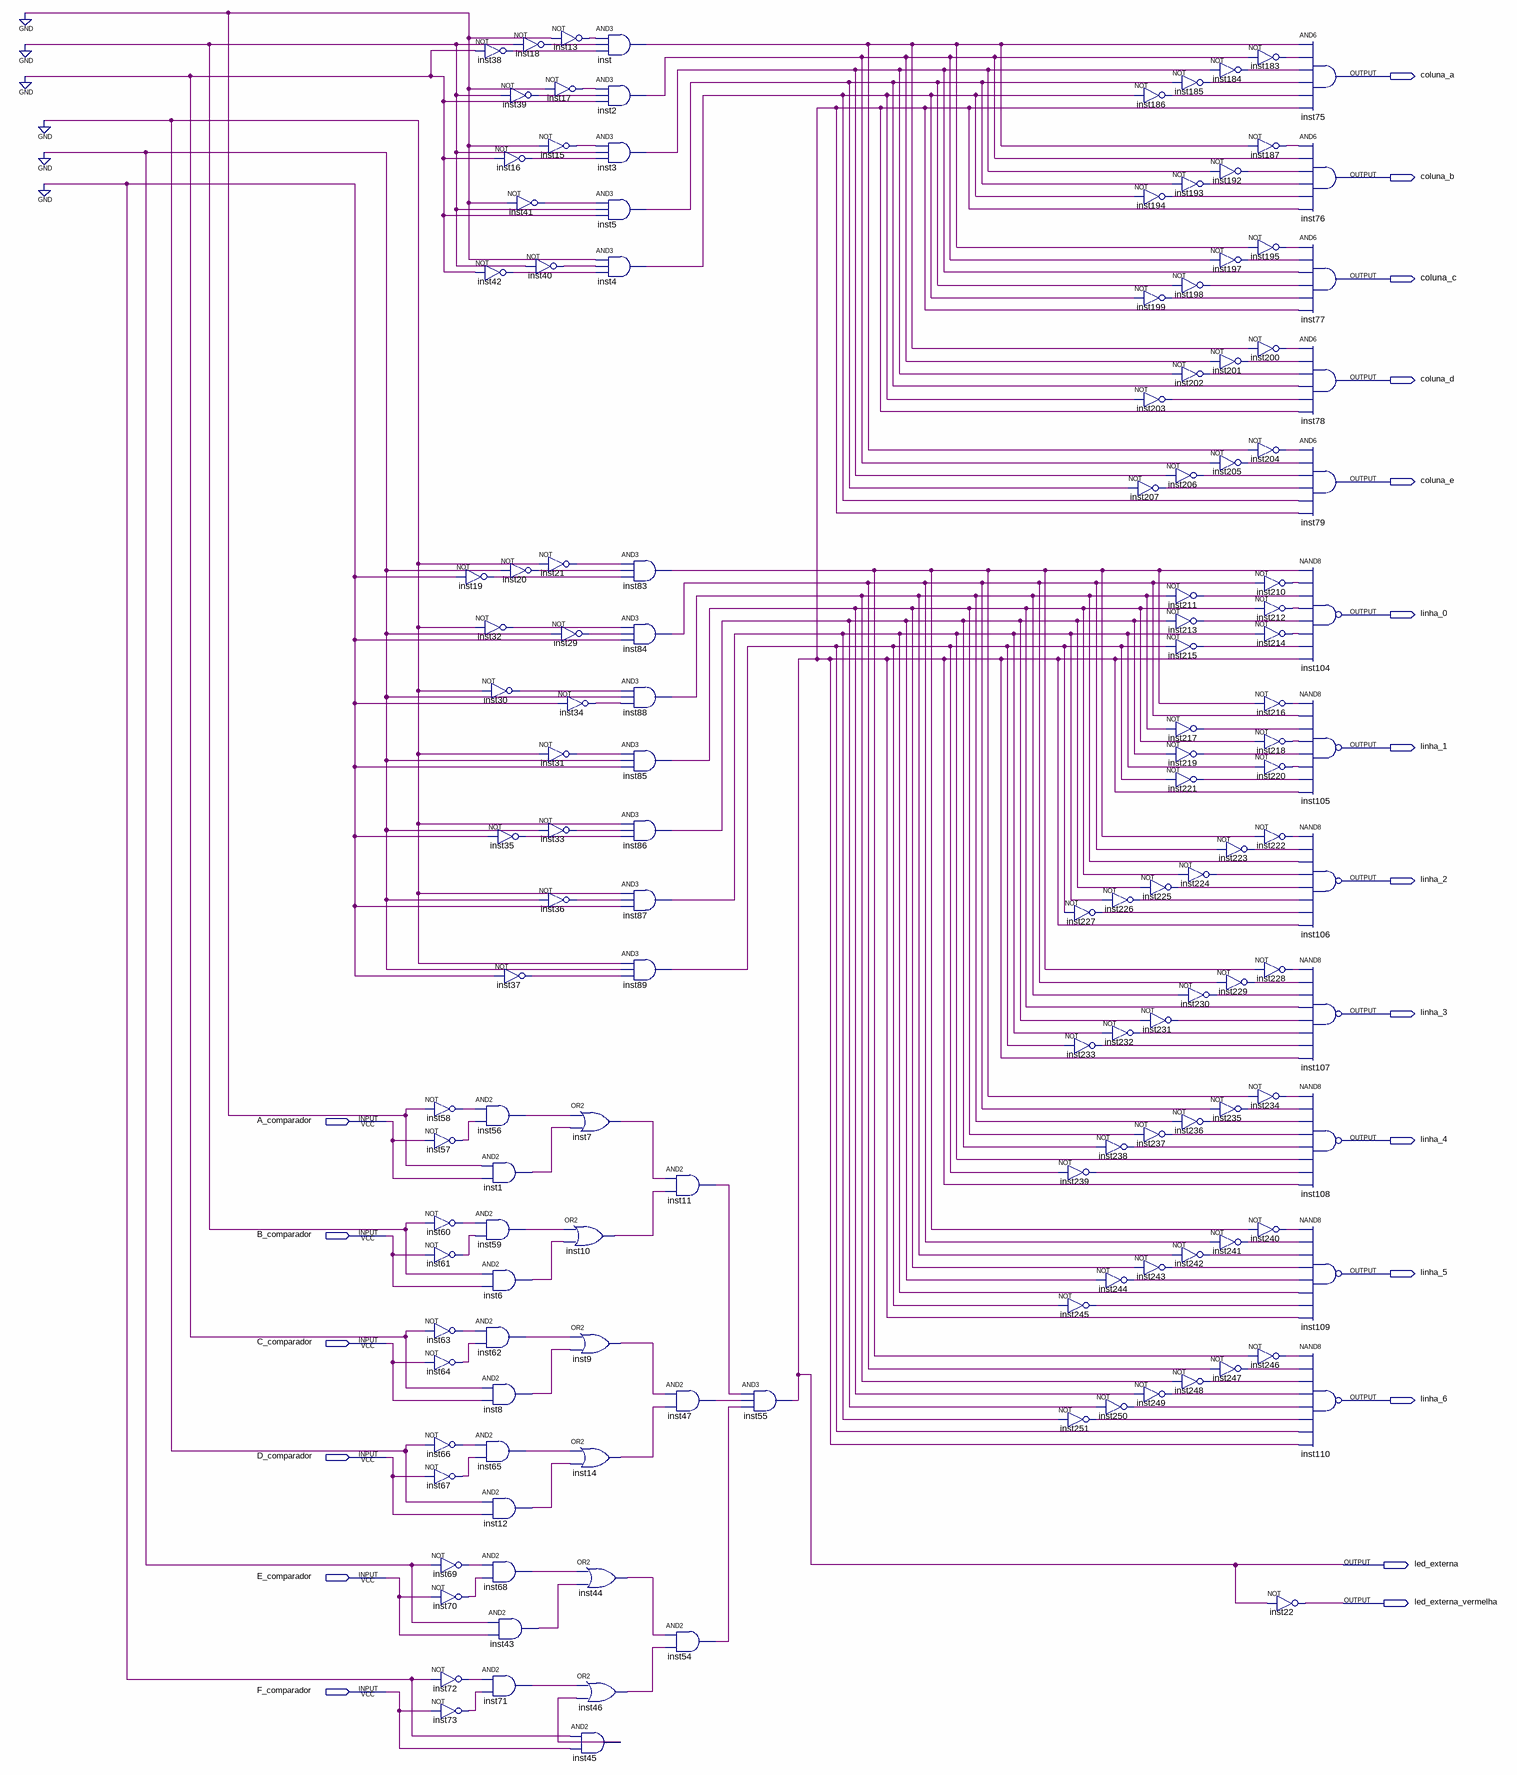
[diagram p0: schematic sheet]
// Quartus schematic PBL_decodificador.bdf as structural Verilog: 143 symbols, 20 pins
module PBL_decodificador (
  input  A_comparador,
  input  B_comparador,
  input  C_comparador,
  input  D_comparador,
  input  E_comparador,
  input  F_comparador,
  output coluna_a,
  output coluna_b,
  output coluna_c,
  output coluna_d,
  output coluna_e,
  output linha_0,
  output linha_1,
  output linha_2,
  output linha_3,
  output linha_4,
  output linha_5,
  output linha_6,
  output led_externa,
  output led_externa_vermelha
);

  wire inst1_out, inst2_out, inst3_out, inst4_out, inst5_out, inst6_out, inst7_out, inst8_out, inst9_out,
       inst10_out, inst11_out, inst12_out, inst13_out, inst14_out, inst15_out, inst16_out, inst17_out,
       inst18_out, inst19_out, inst20_out, inst21_out, inst29_out, inst30_out, inst31_out, inst32_out,
       inst33_out, inst34_out, inst35_out, inst36_out, inst37_out, inst38_out, inst39_out, inst40_out,
       inst41_out, inst42_out, inst43_out, inst44_out, inst45_out, inst46_out, inst47_out, inst54_out,
       inst56_out, inst57_out, inst58_out, inst59_out, inst60_out, inst61_out, inst62_out, inst63_out,
       inst64_out, inst65_out, inst66_out, inst67_out, inst68_out, inst69_out, inst70_out, inst71_out,
       inst72_out, inst73_out, inst83_out, inst84_out, inst85_out, inst86_out, inst87_out, inst88_out,
       inst89_out, inst183_out, inst184_out, inst185_out, inst186_out, inst187_out, inst192_out, inst193_out,
       inst194_out, inst195_out, inst197_out, inst198_out, inst199_out, inst200_out, inst201_out,
       inst202_out, inst203_out, inst204_out, inst205_out, inst206_out, inst207_out, inst210_out,
       inst211_out, inst212_out, inst213_out, inst214_out, inst215_out, inst216_out, inst217_out,
       inst218_out, inst219_out, inst220_out, inst221_out, inst222_out, inst223_out, inst224_out,
       inst225_out, inst226_out, inst227_out, inst228_out, inst229_out, inst230_out, inst231_out,
       inst232_out, inst233_out, inst234_out, inst235_out, inst236_out, inst237_out, inst238_out,
       inst239_out, inst240_out, inst241_out, inst242_out, inst243_out, inst244_out, inst245_out,
       inst246_out, inst247_out, inst248_out, inst249_out, inst250_out, inst251_out, inst_out;

  not inst58 (inst58_out, 1'b0);
  not inst57 (inst57_out, A_comparador);
  not inst60 (inst60_out, 1'b0);
  not inst61 (inst61_out, B_comparador);
  not inst63 (inst63_out, 1'b0);
  not inst64 (inst64_out, C_comparador);
  not inst66 (inst66_out, 1'b0);
  not inst67 (inst67_out, D_comparador);
  not inst69 (inst69_out, 1'b0);
  not inst70 (inst70_out, E_comparador);
  not inst72 (inst72_out, 1'b0);
  not inst73 (inst73_out, F_comparador);
  not inst38 (inst38_out, 1'b0);
  not inst42 (inst42_out, 1'b0);
  not inst19 (inst19_out, 1'b0);
  not inst32 (inst32_out, 1'b0);
  not inst30 (inst30_out, 1'b0);
  not inst35 (inst35_out, 1'b0);
  and inst56 (inst56_out, inst58_out, inst57_out);
  and inst1 (inst1_out, 1'b0, A_comparador);
  and inst59 (inst59_out, inst60_out, inst61_out);
  and inst6 (inst6_out, 1'b0, B_comparador);
  and inst62 (inst62_out, inst63_out, inst64_out);
  and inst8 (inst8_out, 1'b0, C_comparador);
  and inst65 (inst65_out, inst66_out, inst67_out);
  and inst12 (inst12_out, 1'b0, D_comparador);
  and inst68 (inst68_out, inst69_out, inst70_out);
  and inst43 (inst43_out, 1'b0, E_comparador);
  and inst71 (inst71_out, inst72_out, inst73_out);
  not inst18 (inst18_out, 1'b0);
  not inst39 (inst39_out, 1'b0);
  not inst15 (inst15_out, 1'b0);
  not inst16 (inst16_out, 1'b0);
  not inst41 (inst41_out, 1'b0);
  not inst40 (inst40_out, 1'b0);
  not inst21 (inst21_out, 1'b0);
  not inst20 (inst20_out, 1'b0);
  not inst31 (inst31_out, 1'b0);
  not inst33 (inst33_out, 1'b0);
  not inst36 (inst36_out, 1'b0);
  not inst37 (inst37_out, 1'b0);
  not inst13 (inst13_out, 1'b0);
  not inst17 (inst17_out, 1'b0);
  not inst29 (inst29_out, 1'b0);
  not inst34 (inst34_out, 1'b0);
  or inst7 (inst7_out, inst56_out, inst1_out);
  or inst10 (inst10_out, inst59_out, inst6_out);
  or inst9 (inst9_out, inst62_out, inst8_out);
  or inst14 (inst14_out, inst65_out, inst12_out);
  or inst44 (inst44_out, inst68_out, inst43_out);
  or inst46 (inst46_out, inst71_out, inst45_out);
  and inst45 (inst45_out, 1'b0, F_comparador);
  and inst (inst_out, inst13_out, inst18_out, inst38_out);
  and inst2 (inst2_out, inst17_out, inst39_out, 1'b0);
  and inst3 (inst3_out, inst15_out, 1'b0, inst16_out);
  and inst5 (inst5_out, inst41_out, 1'b0, 1'b0);
  and inst4 (inst4_out, 1'b0, inst40_out, inst42_out);
  and inst83 (inst83_out, inst21_out, inst20_out, inst19_out);
  and inst84 (inst84_out, inst32_out, inst29_out, 1'b0);
  and inst88 (inst88_out, inst30_out, 1'b0, inst34_out);
  and inst85 (inst85_out, inst31_out, 1'b0, 1'b0);
  and inst86 (inst86_out, 1'b0, inst33_out, inst35_out);
  and inst87 (inst87_out, 1'b0, inst36_out, 1'b0);
  and inst89 (inst89_out, 1'b0, 1'b0, inst37_out);
  and inst11 (inst11_out, inst7_out, inst10_out);
  and inst47 (inst47_out, inst9_out, inst14_out);
  and inst54 (inst54_out, inst44_out, inst46_out);
  and inst55 (led_externa, inst11_out, inst47_out, inst54_out);
  not inst227 (inst227_out, inst89_out);
  not inst233 (inst233_out, inst89_out);
  not inst238 (inst238_out, inst86_out);
  not inst239 (inst239_out, inst89_out);
  not inst244 (inst244_out, inst86_out);
  not inst245 (inst245_out, inst89_out);
  not inst250 (inst250_out, inst86_out);
  not inst251 (inst251_out, inst87_out);
  not inst186 (inst186_out, inst4_out);
  not inst194 (inst194_out, inst4_out);
  not inst199 (inst199_out, inst4_out);
  not inst203 (inst203_out, inst4_out);
  not inst207 (inst207_out, inst5_out);
  not inst225 (inst225_out, inst86_out);
  not inst226 (inst226_out, inst87_out);
  not inst231 (inst231_out, inst86_out);
  not inst232 (inst232_out, inst87_out);
  not inst237 (inst237_out, inst85_out);
  not inst243 (inst243_out, inst85_out);
  not inst249 (inst249_out, inst85_out);
  not inst185 (inst185_out, inst5_out);
  not inst193 (inst193_out, inst5_out);
  not inst198 (inst198_out, inst5_out);
  not inst202 (inst202_out, inst3_out);
  not inst206 (inst206_out, inst3_out);
  not inst211 (inst211_out, inst88_out);
  not inst213 (inst213_out, inst86_out);
  not inst215 (inst215_out, inst89_out);
  not inst217 (inst217_out, inst88_out);
  not inst219 (inst219_out, inst86_out);
  not inst221 (inst221_out, inst89_out);
  not inst224 (inst224_out, inst85_out);
  not inst230 (inst230_out, inst88_out);
  not inst236 (inst236_out, inst88_out);
  not inst242 (inst242_out, inst88_out);
  not inst248 (inst248_out, inst88_out);
  not inst183 (inst183_out, inst2_out);
  not inst184 (inst184_out, inst3_out);
  not inst187 (inst187_out, inst_out);
  not inst192 (inst192_out, inst3_out);
  not inst195 (inst195_out, inst_out);
  not inst197 (inst197_out, inst2_out);
  not inst200 (inst200_out, inst_out);
  not inst201 (inst201_out, inst2_out);
  not inst204 (inst204_out, inst_out);
  not inst205 (inst205_out, inst2_out);
  not inst223 (inst223_out, inst84_out);
  not inst229 (inst229_out, inst84_out);
  not inst234 (inst234_out, inst83_out);
  not inst235 (inst235_out, inst84_out);
  not inst240 (inst240_out, inst83_out);
  not inst241 (inst241_out, inst84_out);
  not inst246 (inst246_out, inst83_out);
  not inst247 (inst247_out, inst84_out);
  and inst75 (coluna_a, inst_out, inst183_out, inst184_out, inst185_out, inst186_out, led_externa);
  and inst76 (coluna_b, inst187_out, inst2_out, inst192_out, inst193_out, inst194_out, led_externa);
  and inst77 (coluna_c, inst195_out, inst197_out, inst3_out, inst198_out, inst199_out, led_externa);
  and inst78 (coluna_d, inst200_out, inst201_out, inst202_out, inst5_out, inst203_out, led_externa);
  and inst79 (coluna_e, inst204_out, inst205_out, inst206_out, inst207_out, inst4_out, led_externa);
  nand inst104 (linha_0, inst83_out, inst210_out, inst211_out, inst212_out, inst213_out, inst214_out, inst215_out, led_externa);
  not inst210 (inst210_out, inst84_out);
  not inst212 (inst212_out, inst85_out);
  not inst214 (inst214_out, inst87_out);
  nand inst105 (linha_1, inst216_out, inst84_out, inst217_out, inst218_out, inst219_out, inst220_out, inst221_out, led_externa);
  not inst216 (inst216_out, inst83_out);
  not inst218 (inst218_out, inst85_out);
  not inst220 (inst220_out, inst87_out);
  nand inst106 (linha_2, inst222_out, inst223_out, inst88_out, inst224_out, inst225_out, inst226_out, inst227_out, led_externa);
  not inst222 (inst222_out, inst83_out);
  nand inst107 (linha_3, inst228_out, inst229_out, inst230_out, inst85_out, inst231_out, inst232_out, inst233_out, led_externa);
  not inst228 (inst228_out, inst83_out);
  nand inst108 (linha_4, inst234_out, inst235_out, inst236_out, inst237_out, inst238_out, inst87_out, inst239_out, led_externa);
  nand inst109 (linha_5, inst240_out, inst241_out, inst242_out, inst243_out, inst244_out, inst87_out, inst245_out, led_externa);
  nand inst110 (linha_6, inst246_out, inst247_out, inst248_out, inst249_out, inst250_out, inst251_out, inst89_out, led_externa);
  not inst22 (led_externa_vermelha, led_externa);
endmodule
